# Altium project cortina.PrjPcb
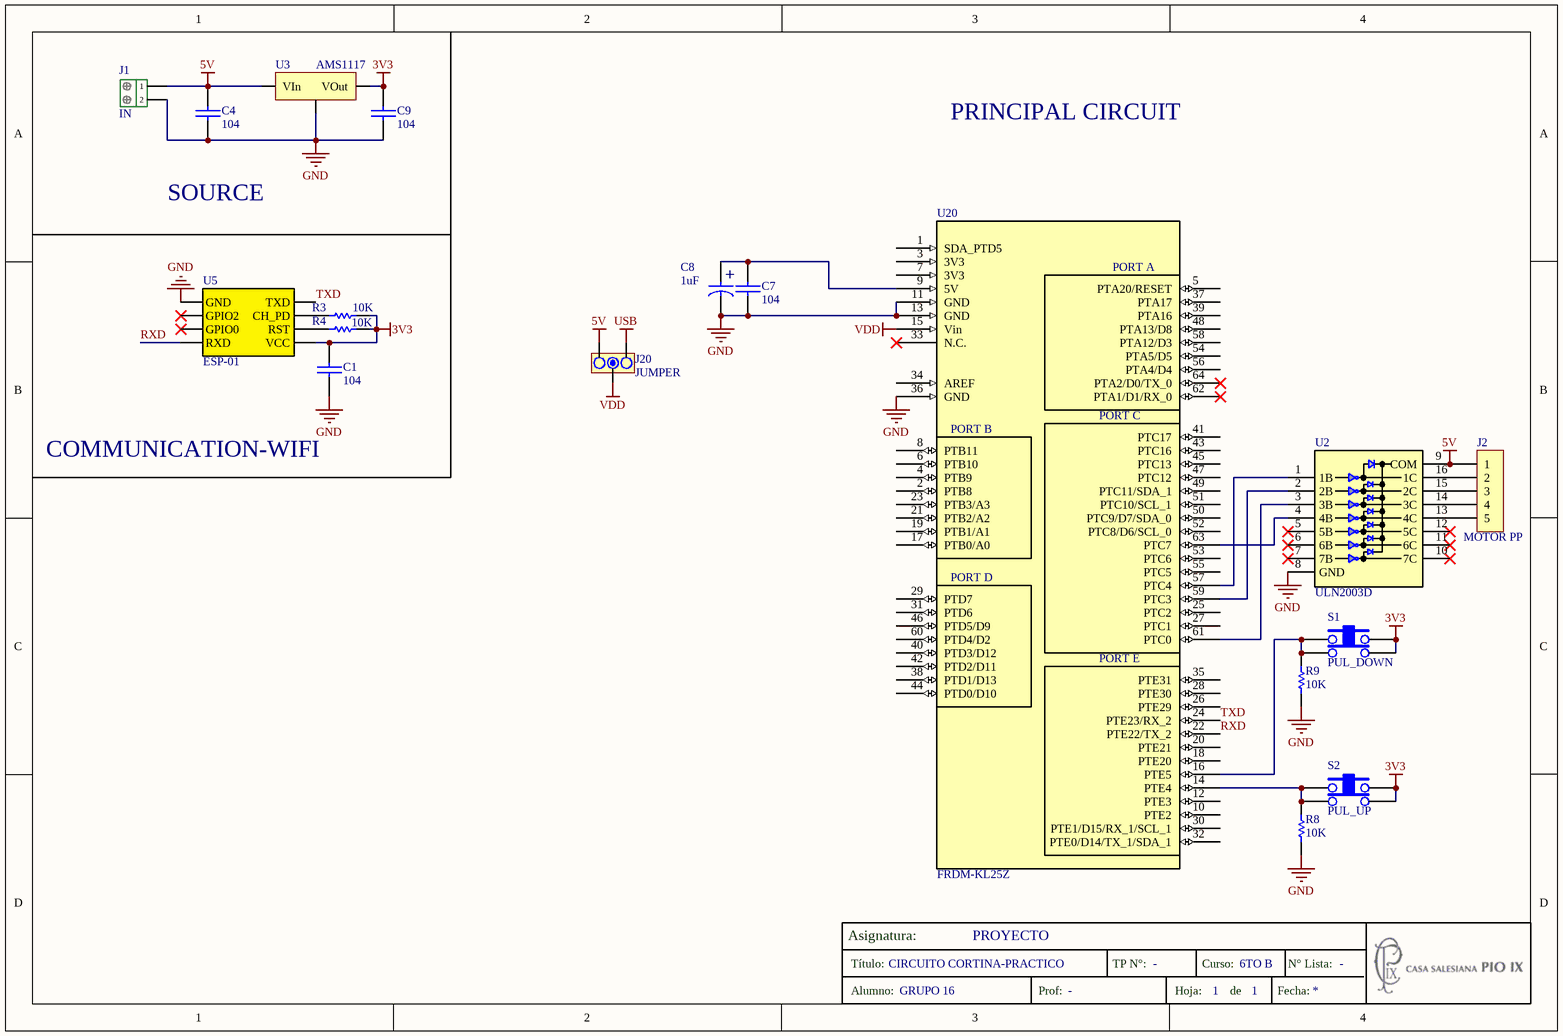
[diagram p0: esq.SchDoc]
1 sheet, 18 parts. Net scope: global (net labels, ports and power ports of the same name join across sheets).
Board files: pcb.PcbDoc, panel.PcbDoc

## Sheet esq.SchDoc
size A4; SheetNumber: 1; SheetTotal: 1; Titulo: CIRCUITO CORTINA-PRACTICO; Alumno: GRUPO 16; profesor: -; curso: 6TO B; TPN: -; NLista: -; Asignatura: PROYECTO; Año: 2020; Rule: PcbType=ProtelPcb

### Parts
C1  104  [0805]
C4  104  [0805]
C7  104  [0805]
C8  1uF  [CAP100RP]
C9  104  [0805]
J1  IN  [BORNERA2]
J2  MOTOR PP  [SIP5]
J20  JUMPER  [JUMPER3]
R3  10K  [0805]
R4  10K  [0805]
R8  10K  [0805]
R9  10K  [0805]
S1  PUL_DOWN  [TACTSWITCH]
S2  PUL_UP  [TACTSWITCH]
U2  ULN2003D  [SOIC16]
U3  AMS1117  [AMS1117]
U5  ESP-01  [ESP-01]
U20  FRDM-KL25Z  [MICRO]

### Nets
3V3: C1.2 C9.1 R3.1 R4.1 S1.3 S1.4 S2.3 S2.4 U3.3(VOut) U5.8(VCC)
5V: C4.1 J1.1 J2.1 J20.1 U2.9(COM) U3.1(VIn)
GND: C1.1 C4.2 C7.1 C8.2 C9.2 J1.2 R8.1 R9.1 U2.8(GND) U3.2(GND) U5.1(GND) U20.11(GND) U20.13(GND) U20.36(GND)
USB: J20.3
VDD: J20.2 U20.15(Vin)
RXD: U5.4(RXD) U20.22(PTE22/TX_2)
TXD: U5.5(TXD) U20.24(PTE23/RX_2)
NetC7_2: C7.2 C8.1 U20.9(5V)
NetJ2_2: J2.2 U2.16(1C)
NetJ2_3: J2.3 U2.15(2C)
NetJ2_4: J2.4 U2.14(3C)
NetJ2_5: J2.5 U2.13(4C)
NetR3_2: R3.2 U5.6(CH_PD)
NetR4_2: R4.2 U5.7(RST)
NetR8_2: R8.2 S2.1 S2.2 U20.14(PTE4)
NetR9_2: R9.2 S1.1 S1.2 U20.16(PTE5)
NetU2_1: U2.1(1B) U20.57(PTC4)
NetU2_2: U2.2(2B) U20.59(PTC3)
NetU2_3: U2.3(3B) U20.61(PTC0)
NetU2_4: U2.4(4B) U20.63(PTC7)

Not connected (* = marked no-connect by the designer): U2 5(5B)* 6(6B)* 7(7B)* 10(7C)* 11(6C)* 12(5C)*; U5 2(GPIO2)* 3(GPIO0)*; U20 1(SDA_PTD5) 2(PTB8) 3(3V3) 4(PTB9) 5(PTA20/RESET) 6(PTB10) 7(3V3) 8(PTB11) 10(PTE2) 12(PTE3) 17(PTB0/A0) 18(PTE20) 19(PTB1/A1) 20(PTE21) 21(PTB2/A2) 23(PTB3/A3) 25(PTC2) 26(PTE29) 27(PTC1) 28(PTE30) 29(PTD7) 30(PTE1/D15/RX_1/SCL_1) 31(PTD6) 32(PTE0/D14/TX_1/SDA_1) 33(N.C.)* 34(AREF) 35(PTE31) 37(PTA17) 38(PTD1/D13) 39(PTA16) 40(PTD3/D12) 41(PTC17) 42(PTD2/D11) 43(PTC16) 44(PTD0/D10) 45(PTC13) 46(PTD5/D9) 47(PTC12) 48(PTA13/D8) 49(PTC11/SDA_1) 50(PTC9/D7/SDA_0) 51(PTC10/SCL_1) 52(PTC8/D6/SCL_0) 53(PTC6) 54(PTA5/D5) 55(PTC5) 56(PTA4/D4) 58(PTA12/D3) 60(PTD4/D2) 62(PTA1/D1/RX_0)* 64(PTA2/D0/TX_0)*

### Notes on the sheet
- PRINCIPAL CIRCUIT
- SOURCE
- (near U20) PRINCIPAL CIRCUIT
- COMMUNICATION-WIFI
- Asignatura:
- Título:
- TP N°:
- Curso:
- N° Lista:
- Alumno:
- Prof:
- Hoja:
- de
- Fecha:
- (in symbol CAPPOL) +
- (in symbol FRDM-KL25Z) PORT A; PORT C; PORT B; PORT D; PORT E
- (in symbol MC9S08SH8) PORT B; PORT A; PORT C

### Library data of the parts
C1 C4 C7 C9 = CAP: Autor: Guido Spataro; Data: Libebal; Fecha: 07/04/19
C8 = CAPPOL: Cap polarizado
J1 = Bornera_2: Bornera de 2 pines; Autor: Guido Spataro; Datasheet: Libebal; Fecha: 07/04/19
J2 = CON5
J20 = JUMPER3
R3 R4 R8 R9 = RES: Resistencia; Autor: Guido Spataro; Data: Libebal; Fecha: 07/04/19
S1 S2 = TACT SWITCH
U2 = ULN2003D: Controlador de corriente; AUTOR: MARTINEZ Agustin; FECHA: 5/4; DATASHEET: https://pdf1.alldatasheet.com/datasheet-pdf/view/25572/STMICROELECTRONICS/ULN2003D.html
U20 = FRDM-KL25Z: Autor: Guido Spataro; data: https://www.nxp.com/docs/en/data-sheet/MC9S08SH8.pdf; Fecha: 07/04/19